# EAGLE design design (EAGLE 9.6.2)
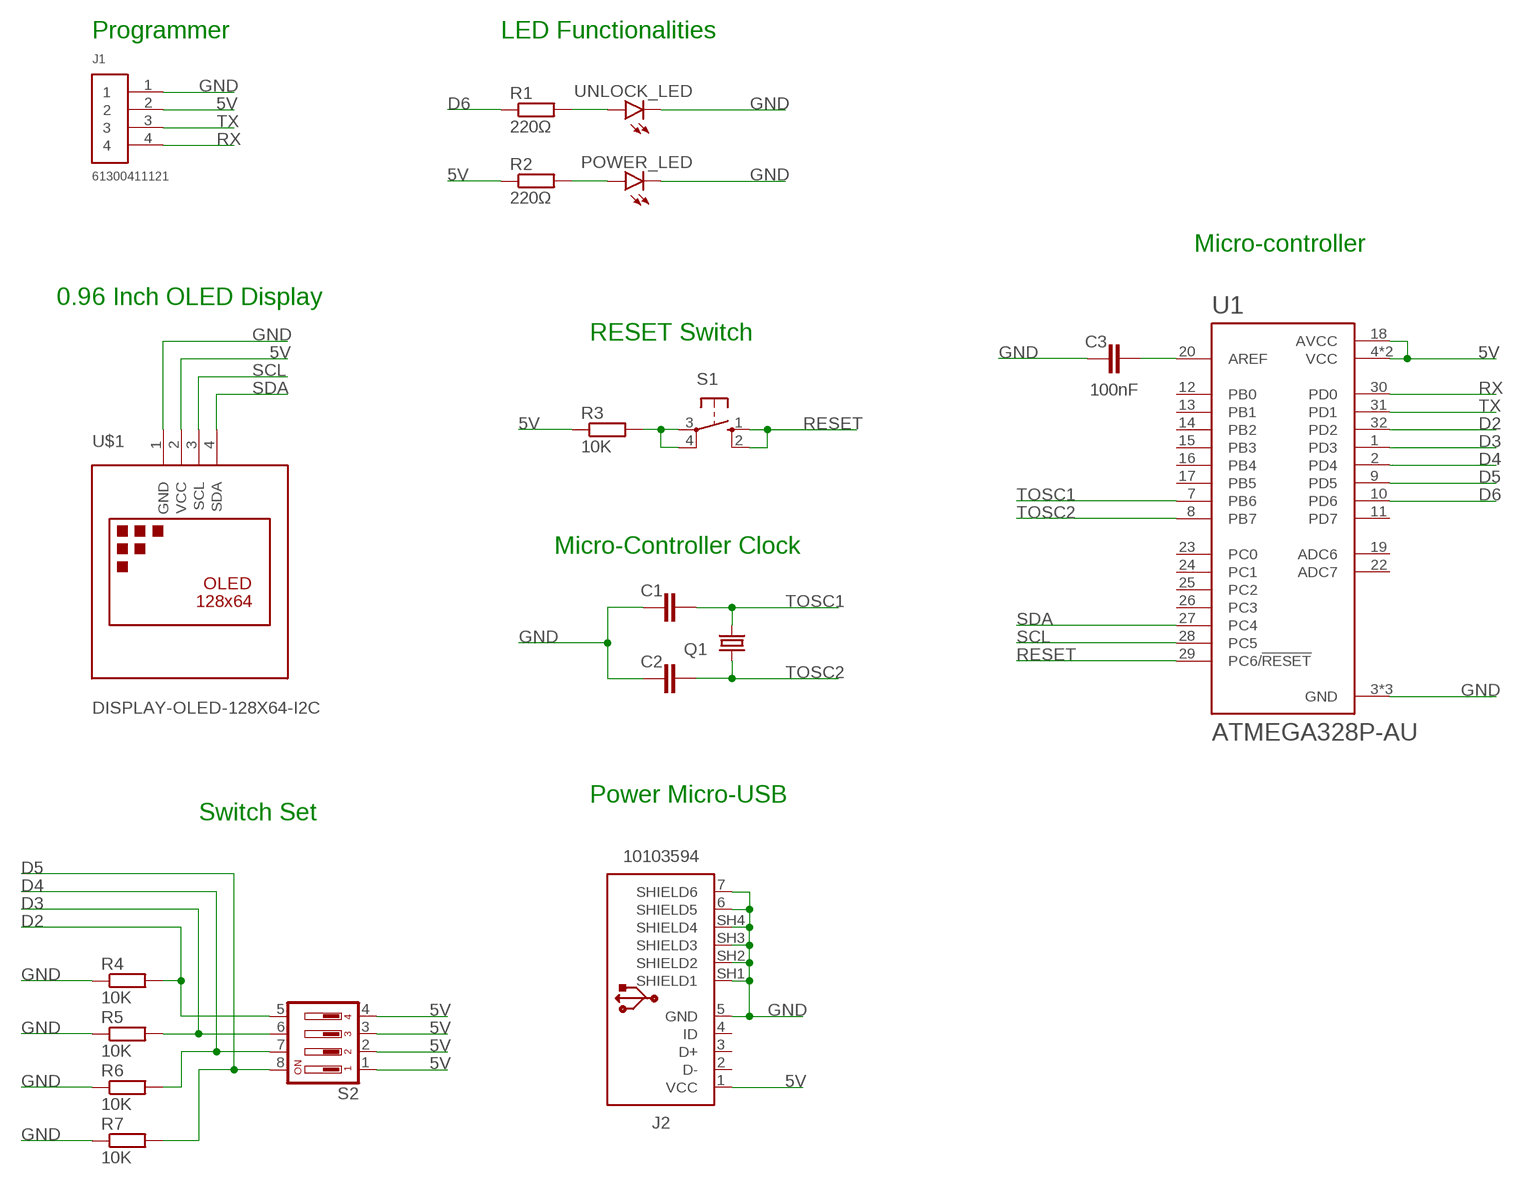
[diagram p0: schematic, sheet 1]

## Parts
C1  C-EUC0805  [C0805]
C2  C-EUC0805  [C0805]
C3  100nF  C-EUC0805  [C0805]
J1  61300411121  [61300411121]
J2  10103594  [10103594]
POWER_LED  LEDCHIP-LED0805  [CHIP-LED0805]
Q1  CRYSTALHC49U-V  [HC49U-V]
R1  220Ω  R-EU_R0805  [R0805]
R2  220Ω  R-EU_R0805  [R0805]
R3  10K  R-EU_R0805  [R0805]
R4  10K  R-EU_R0805  [R0805]
R5  10K  R-EU_R0805  [R0805]
R6  10K  R-EU_R0805  [R0805]
R7  10K  R-EU_R0805  [R0805]
S1  10-XX  [B3F-10XX]
S2  DA04  [DA-04]
U1  ATMEGA328P-AU  [QFP80P900X900X120-32N]
U$1  DISPLAY-OLED-128X64-I2C  [DISPLAY-OLED-128X64-I2C]
UNLOCK_LED  LEDCHIP-LED0805  [CHIP-LED0805]

## Nets
5V: J1.2 J2.1(VCC) R2.1 R3.1 S2.1 S2.2 S2.3 S2.4 U1.4(VCC) U1.6(VCC) U1.18(AVCC) U$1.2(VCC)
D2: R4.2 S2.5 U1.32(PD2)
D3: R5.2 S2.6 U1.1(PD3)
D4: R6.2 S2.7 U1.2(PD4)
D5: R7.2 S2.8 U1.9(PD5)
D6: R1.1 U1.10(PD6)
GND: C1.1 C2.1 C3.1 J1.1 J2.5(GND) J2.6(SHIELD5) J2.7(SHIELD6) J2.SH1(SHIELD1) J2.SH2(SHIELD2) J2.SH3(SHIELD3) J2.SH4(SHIELD4) POWER_LED.C R4.1 R5.1 R6.1 R7.1 U1.3(GND) U1.5(GND) U1.21(GND) U$1.1(GND) UNLOCK_LED.C
N$1: R1.2 UNLOCK_LED.A
N$2: R3.2 S1.3(P) S1.4(P1)
N$3: POWER_LED.A R2.2
N$4: C3.2 U1.20(AREF)
RESET: S1.1(S) S1.2(S1) U1.29(PC6/!RESET)
RX: J1.4 U1.30(PD0)
SCL: U1.28(PC5) U$1.3(SCL)
SDA: U1.27(PC4) U$1.4(SDA)
TOSC1: C1.2 Q1.2 U1.7(PB6)
TOSC2: C2.2 Q1.1 U1.8(PB7)
TX: J1.3 U1.31(PD1)
Unconnected: J2.2(D-) J2.3(D+) J2.4(ID) U1.11(PD7) U1.12(PB0) U1.13(PB1) U1.14(PB2) U1.15(PB3) U1.16(PB4) U1.17(PB5) U1.19(ADC6) U1.22(ADC7) U1.23(PC0) U1.24(PC1) U1.25(PC2) U1.26(PC3)

## Notes on the sheet
- Programmer | LED Functionalities
- Micro-controller
- 0.96 Inch OLED Display
- RESET Switch
- Micro-Controller Clock
- Power Micro-USB
- Switch Set

## Library data of the parts
C1-C3 = resistor:C-EU: CAPACITOR, European symbol
J1 = Headers:61300411121: CONN HEADER VERT 4POS 2.54MM Manufacturer's datasheet <https://katalog.we-online.de/em/datasheet/6130xx11121.pdf>; CREATED_BY: PCBLayout.com; DIGI_KEY_PART_NUMBER: 732-5317-ND; MANUFACTURER: Wurth Electronics Inc.; MPN: 61300411121
J2 = Connector_USB:10103594: USB(2.0) Micro-B, RCPT, 5POS, SMD-THT-R/A Datasheet <https://cdn.amphenol-icc.com/media/wysiwyg/files/documentation/datasheet/inputoutput/io_usb_micro.pdf> Drawing <https://cdn.amphenol-icc.com/media/wysiwyg/files/drawing/10103594.pdf>; CATEGORY: Connectors; CONTACTS: 5; CURRENT-RATING: 1.8A; DESCRIPTION: CONN RCPT USB2.0 MICRO B SMD R/A; GENDER: Receptacle; MANUFACTURER: Amphenol ICC (FCI); MOUNT_TYPE: R/A; MPN: 10103594-0001LF; OPERATING_TEMPERATURE: -30°C ~ 80°C; PART_STATUS: ACTIVE; ROHS_COMPLIANT: COMPLIANT; SUB_CATEGORY: USB; TYPE: USB-micro B; VOLTAGE-RATING: 100VAC
POWER_LED UNLOCK_LED = led:LED: LED OSRAM: - CHIPLED LG R971, LG N971, LY N971, LG Q971, LY Q971, LO R971, LY R971 LH N974, LH R974 LS Q976, LO Q976, LY Q976 LO Q996 - Hyper CHIPLED LW Q18S LB Q993, LB Q99A, LB R99A - SideLED LS A670, LO A670, LY A670, LG A670, LP A670 LB A673, LV A673, LT A673, LW A673 LH A674 LY A675 LS A676, LA A676, LO A676, LY A676, LW A676 LS A679, LY A679, LG A679 - Hyper Micro SIDELED® LS Y876, LA Y876, LO Y876, LY Y876 LT Y87S - SmartLED LW L88C, LW L88S LB L89C, LB L89S, LG L890 LS L89K, LO L89K, LY L89K LS L896, LA L896, LO L896, LY L896 - TOPLED LS T670, LO T670, LY T670, LG T670, LP T670 LSG T670, LSP T670, LSY T670, LOP T670, LYG T670 LG T671, LOG T671, LSG T671 LB T673, LV T673, LT T673, LW T673 LH T674 LS T676, LA T676, LO T676, LY T676, LB T676, LH T676, LSB T676, LW T676 LB T67C, LV T67C, LT T67C, LS T67K, LO T67K, LY T67K, LW E67C LS E67B, LA E67B, LO E67B, LY E67B, LB E67C, LV E67C, LT E67C LW T67C LS T679, LY T679, LG T679 LS T770, LO T770, LY T770, LG T770, LP T770 LB T773, LV T773, LT T773, LW T773 LH T774 LS E675, LA E675, LY E675, LS T675 LS T776, LA T776, LO T776, LY T776, LB T776 LHGB T686 LT T68C, LB T68C - Hyper Mini TOPLED® LB M676 - Mini TOPLED Santana® LG M470 LS M47K, LO M47K, LY M47K Source: http://www.osram.convergy.de LUXEON: - LUMILED® LXK2-PW12-R00, LXK2-PW12-S00, LXK2-PW14-U00, LXK2-PW14-V00 LXK2-PM12-R00, LXK2-PM12-S00, LXK2-PM14-U00 LXK2-PE12-Q00, LXK2-PE12-R00, LXK2-PE12-S00, LXK2-PE14-T00, LXK2-PE14-U00 LXK2-PB12-K00, LXK2-PB12-L00, LXK2-PB12-M00, LXK2-PB14-N00, LXK2-PB14-P00, LXK2-PB14-Q00 LXK2-PR12-L00, LXK2-PR12-M00, LXK2-PR14-Q00, LXK2-PR14-R00 LXK2-PD12-Q00, LXK2-PD12-R00, LXK2-PD12-S00 LXK2-PH12-R00, LXK2-PH12-S00 LXK2-PL12-P00, LXK2-PL12-Q00, LXK2-PL12-R00 Source: www.luxeon.com KINGBRIGHT: KA-3528ASYC Source: www.kingbright.com
Q1 = crystal:CRYSTAL: CRYSTAL; OC_FARNELL: 1666969; OC_NEWARK: unknown
R1-R7 = resistor:R-EU_: RESISTOR, European symbol
S1 = switch-omron:10-XX: OMRON SWITCH; MPN: B3F-1000; OC_FARNELL: 176432; OC_NEWARK: 36M3542
S2 = switch-dil:DA04: DIL/CODE SWITCH; MPN: MCDA04; OC_FARNELL: 9471545; OC_NEWARK: 26M1090
U1 = ATMEGA328P-AU:ATMEGA328P-AU: ATmega Series 20 MHz 32 KB Flash 2 KB SRAM 8-Bit Microcontroller - TQFP-32 Check prices <https://pricing.snapeda.com/parts/ATMEGA328P-AU/Microchip%20Technology/view-part?ref=eda>; AVAILABILITY: In Stock; DESCRIPTION: AVR AVR® ATmega Microcontroller IC 8-Bit 20MHz 32KB (16K x 16) FLASH 32-TQFP (7x7); MF: Microchip Technology; MP: ATMEGA328P-AU; PACKAGE: TQFP-32 Microchip; PRICE: None
U$1 = diy-modules:DISPLAY-OLED-128X64-I2C: 128x64 Dot Matrix OLED Module based on SSD1306 chip Variant with I2C interface More details available here: http://www.instructables.com/id/Monochrome-096-i2c-OLED-display-with-arduino-SSD13/ SSD1306 datasheet: https://cdn-shop.adafruit.com/datasheets/SSD1306.pdf Click here to find device on ebay.com <http://www.ebay.com/sch/oled+display+128x64+iic> Note: There are two variants: I2C and SPI. Search for the proper version.

## Board
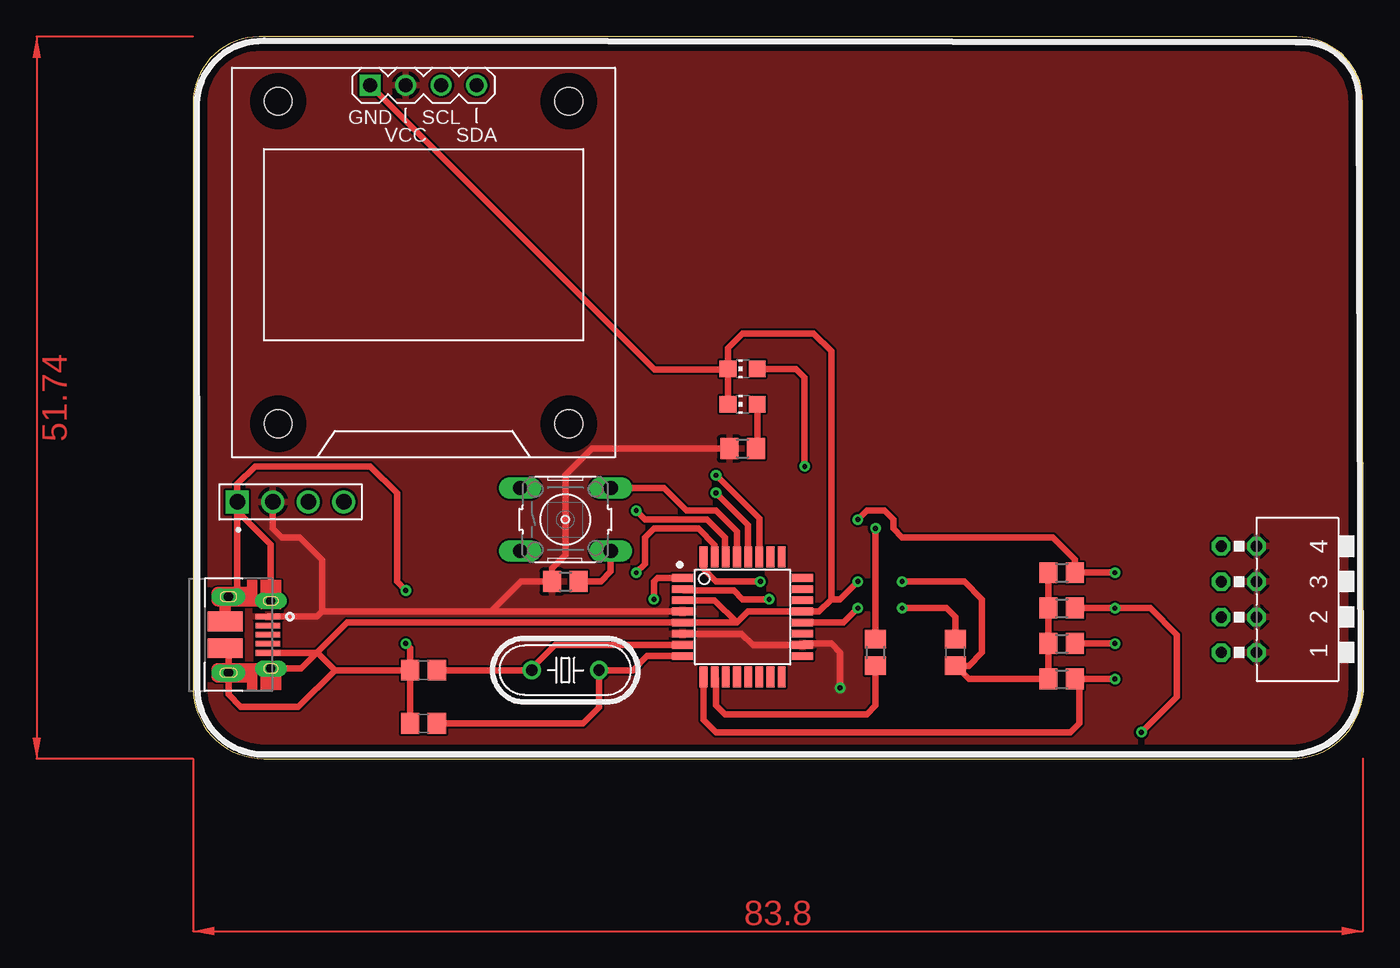
[diagram p1: board, top side]
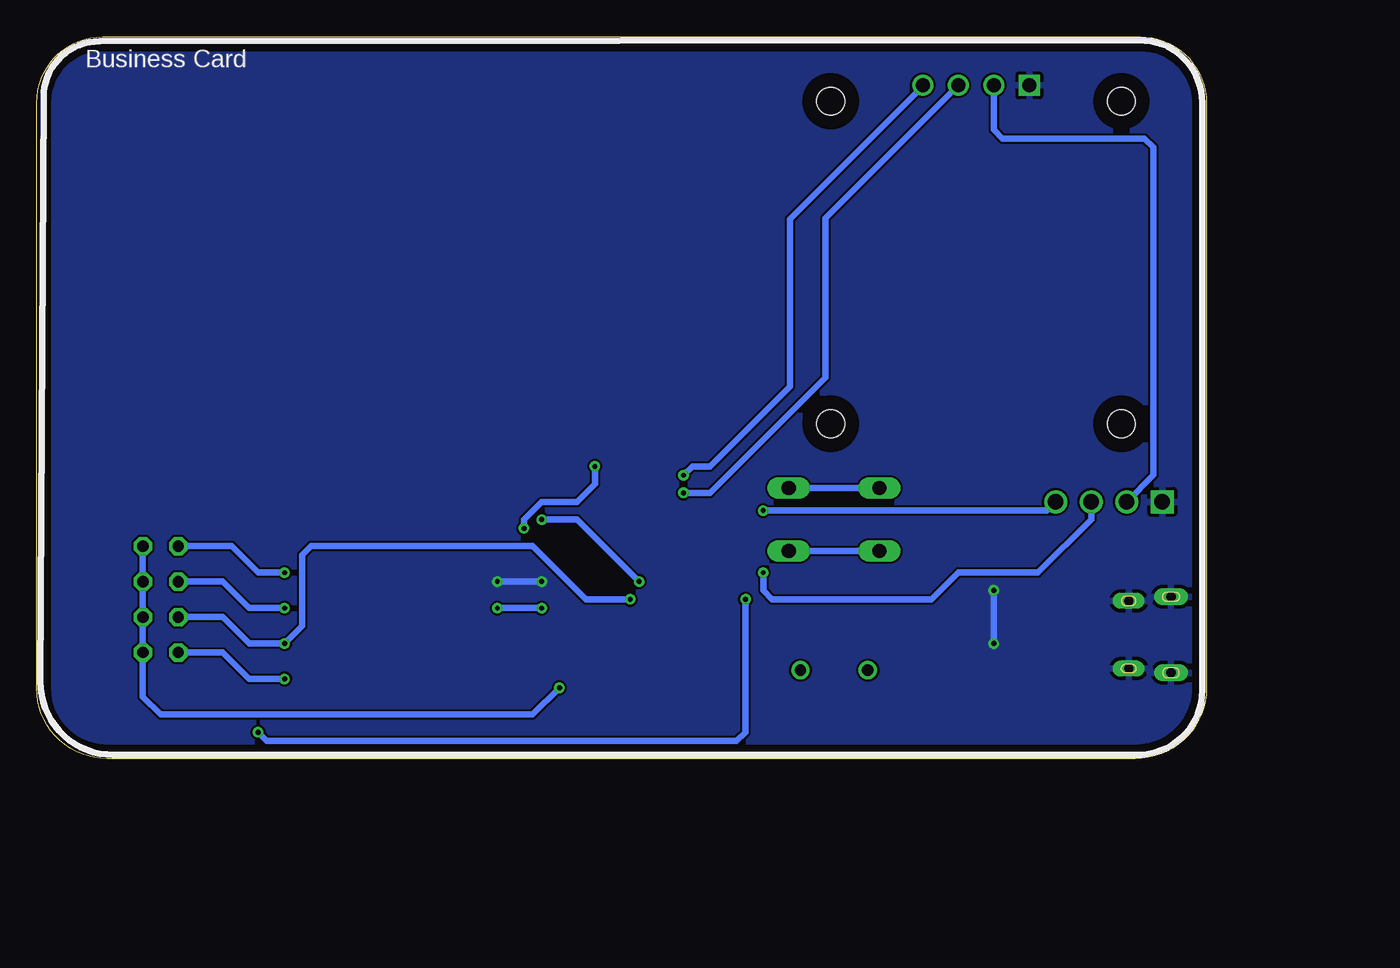
[diagram p2: board, bottom side, seen from below]

Size 83.8 x 51.74 mm. Coordinates in mm from the lower left corner, seen from the top.
Outline: 0,46.99 0,5.08 arc90 5.08,0 78.74,0 arc90 83.8,5.06 83.8,47.01 arc90 79.07,51.74 4.75,51.74 arc90 0,46.99
Copper layers (1*16): Top 0.035mm / dielectric 1.5mm / Bottom 0.035mm
Design rules "default": minimum track width 6mil, minimum drill 0.35mm, track to track 6mil, track to pad 6mil, pad to pad 6mil, via to via 6mil, smd to smd 6mil, copper to edge 40mil, drill to drill 6mil, minimum pad ring 10mil, minimum via ring 8mil, stop-mask expansion 4mil, vias tented up to drill 0mil, thermal gap 10mil

### Footprints (pad centres in the part's own frame; a part is rotated, then mirrored left to right if it is on the bottom)
C0805 = smd 1.3 x 1.5: 1 -0.95,0; 2 0.95,0
61300411121 = drill 1.1 square: 1 -3.81,0 | drill 1.1: 2 -1.27,0; 3 1.27,0; 4 3.81,0
10103594 = smd 0.4 x 1.75: 1 -1.3,2.825; 2 -0.65,2.825; 3 0,2.825; 4 0.65,2.825; 5 1.3,2.825 | smd 1.425 x 2.5: 6 -0.963,-0.25; 7 0.963,-0.25 | drill 0.65 pad 0.73 long: SH1 -2.425,3.03; SH2 2.425,3.03 | drill 0.7 long: SH3 -2.725,0; SH4 2.725,0
CHIP-LED0805 = smd 1.2 x 1.2: A 0,-1.05; C 0,1.05
HC49U-V = drill 0.813: 1 -2.413,0; 2 2.413,0
R0805 = smd 1.3 x 1.5: 1 -0.95,0; 2 0.95,0
B3F-10XX = drill 1.016 long: 1 -3.251,2.261; 2 3.251,2.261; 3 -3.251,-2.261; 4 3.251,-2.261
DA-04 = drill 0.813 octagon: 1 -3.81,-1.27; 2 -1.27,-1.27; 3 1.27,-1.27; 4 3.81,-1.27; 5 3.81,1.27; 6 1.27,1.27; 7 -1.27,1.27; 8 -3.81,1.27
QFP80P900X900X120-32N = smd 1.5 x 0.55: 1 -4.3,2.8; 2 -4.3,2; 3 -4.3,1.2; 4 -4.3,0.4; 5 -4.3,-0.4; 6 -4.3,-1.2; 7 -4.3,-2; 8 -4.3,-2.8; 17 4.3,-2.8; 18 4.3,-2; 19 4.3,-1.2; 20 4.3,-0.4; 21 4.3,0.4; 22 4.3,1.2; 23 4.3,2; 24 4.3,2.8 | smd 0.55 x 1.5: 9 -2.8,-4.3; 10 -2,-4.3; 11 -1.2,-4.3; 12 -0.4,-4.3; 13 0.4,-4.3; 14 1.2,-4.3; 15 2,-4.3; 16 2.8,-4.3; 25 2.8,4.3; 26 2,4.3; 27 1.2,4.3; 28 0.4,4.3; 29 -0.4,4.3; 30 -1.2,4.3; 31 -2,4.3; 32 -2.8,4.3
DISPLAY-OLED-128X64-I2C = drill 1 square: 1 -3.81,12.7 | drill 1: 2 -1.27,12.7; 3 1.27,12.7; 4 3.81,12.7 | hole 2: -10.414,11.557; 10.414,11.557; 10.414,-11.557; -10.414,-11.557

### Placement (x,y rotation side)
C1  16.51,6.35 0 top
C2  16.51,2.54 0 top
C3  54.61,7.62 90 top
J1  6.99,18.41 0 top
J2  2.54,8.89 270 top
POWER_LED  39.37,25.4 90 top
Q1  26.67,6.35 180 top
R1  48.9,7.62 90 top
R2  39.37,22.22 0 top
R3  26.67,12.7 0 top
R4  62.23,13.33 0 top
R5  62.23,10.79 0 top
R6  62.23,8.25 0 top
R7  62.23,5.72 0 top
S1  26.67,17.14 0 top
S2  74.93,11.43 90 top
U1  39.37,10.16 0 top
U$1  16.51,35.56 0 top
UNLOCK_LED  39.37,27.94 90 top

### Tracks (layer width: path | path; a pad name or v marks a point on that pad's centre or on a via)
5V  (via drill 0.35)
  Top 0.152: 8.86,10.19 8.92,10.19 8.92,10.22 | U1.18 43.76,8.25
  Top 0.457: J2.1 8.86,10.19 | U1.18 40.1,8.16 39.3,8.96 U1.6 | U1.4 21.35,10.56 | 21.35,10.56 9.26,10.56 | 9.26,10.56 8.92,10.22 | R2.1 28.57,22.22 26.67,20.32 26.67,14.6 25.72,13.65 R3.1 23.49,12.7 21.35,10.56 | 43.76,8.25 45.72,8.25 46.35,7.62 v46.35,5.08 | J1.2 5.71,16.51 6.35,15.87 7.62,15.87 9.26,14.23 9.26,10.56
  Bottom 0.457: S2.4 S2.3 S2.2 S2.1 76.2,4.44 74.93,3.17 48.26,3.17 v46.35,5.08 | J1.2 3.81,20.32 3.81,43.81 4.44,44.45 14.6,44.45 15.24,45.08 U$1.2
  pour Top: 0.36,46.48 arc-90 4.78,50.9 4.78,51.13 80.37,51.13 arc-90 83.26,48.23 83.26,4.11 arc-90 79.38,0.23 4.78,0.23 arc-90 0.28,4.72 0.28,46.41
D2  (via drill 0.35)
  Top 0.457: v66.04,13.33 R4.2 63.18,14.29 61.59,15.87 50.8,15.87 50.16,16.51 50.16,17.14 49.53,17.78 48.26,17.78 v47.62,17.14 | U1.32 36.57,13.59 37.46,12.7 v40.64,12.7
  Bottom 0.457: S2.5 69.85,15.24 67.94,13.33 v66.04,13.33 | v40.64,12.7 45.08,17.14 v47.62,17.14
D3  (via drill 0.35)
  Top 0.457: R5.2 v66.04,10.79 68.58,10.79 70.48,8.89 70.48,4.44 v67.94,1.9 | U1.1 33.28,12.96 33.02,12.7 v33.02,11.43
  Bottom 0.457: v66.04,10.79 68.58,10.79 70.48,12.7 S2.6 | v33.02,11.43 33.02,1.9 33.65,1.27 67.31,1.27 v67.94,1.9
D4  (via drill 0.35)
  Top 0.457: R6.2 v66.04,8.25 | U1.2 35.16,12.06 38.73,12.06 39.37,11.43 v41.27,11.43
  Bottom 0.457: S2.7 70.48,10.16 68.58,8.25 v66.04,8.25 64.77,9.52 64.77,14.6 64.13,15.24 48.26,15.24 44.45,11.43 v41.27,11.43
D5  (via drill 0.35)
  Top 0.457: v66.04,5.71 R7.2 63.5,5.39 63.5,2.54 62.86,1.9 37.46,1.9 36.57,2.8 U1.9
  Bottom 0.457: v66.04,5.71 68.58,5.71 70.48,7.62 S2.8
D6
  Top 0.152: U1.10 37.46,5.76
  Top 0.457: 37.46,5.76 37.46,3.81 38.1,3.17 48.26,3.17 48.89,3.81 R1.1
GND  (via drill 0.35)
  Top 0.152: 2.54,7.68 J2.7 | 2.29,11.36 J2.SH3 3.17,12.25 | 8.86,7.59 8.89,7.62
  Top 0.457: C2.1 C1.1 | 8.89,7.62 10.16,6.35 | 10.16,6.35 C1.1 | 8.89,7.62 11.03,9.76 U1.5 38.97,9.76 | 38.97,9.76 39.77,10.56 U1.21 44.85,10.56 45.72,11.43 | 38.32,27.89 UNLOCK_LED.C 38.32,29.43 39.37,30.48 44.45,30.48 45.72,29.21 45.72,11.43 | 38.32,27.89 POWER_LED.C | U$1.1 33.07,27.89 38.32,27.89 | 45.72,11.43 46.35,11.43 v47.62,12.7 | v50.8,12.7 55.24,12.7 56.51,11.43 56.51,7.62 55.56,6.67 C3.1 55.56,5.71 R7.1 R6.1 R5.1 R4.1 | v15.24,12.06 14.6,12.7 14.6,19.05 12.7,20.95 4.44,20.95 3.17,19.68 J1.1 3.17,17.75 | C1.1 15.56,7.93 v15.24,8.25 | 10.16,6.35 7.54,3.73 3.4,3.73 2.54,4.6 J2.SH4 2.54,7.68 | J2.SH3 3.04,12.12 3.63,12.12 | 3.17,12.25 3.17,17.75 | J2.SH1 5.57,15.36 3.17,17.75 | U1.3 37.37,11.36 38.97,9.76 | J2.SH2 7.73,6.46 8.89,7.62 | J2.5 8.86,7.59
  Top 0.813: J2.6 2.29,11.36
  Bottom 0.457: v47.62,12.7 v50.8,12.7 | v15.24,12.06 v15.24,8.25
  pour Bottom: 4.7,50.83 80.52,50.83 arc-90 83.03,48.31 83.03,3.35 arc-90 79.91,0.23 4.7,0.23 arc-90 0.36,4.57 0.36,46.48 arc-90
N$1  (via drill 0.35)
  Top 0.457: UNLOCK_LED.A 43.18,27.94 43.81,27.3 v43.81,20.95 | R1.2 v48.89,16.51
  Bottom 0.457: v43.81,20.95 43.81,19.68 45.08,18.41 47.62,18.41 48.89,17.14 v48.89,16.51
N$2
  Top 0.457: S1.4 29.92,13.41 29.21,12.7 R3.2
  Bottom 0.457: S1.3 S1.4
N$3
  Top 0.152: 40.42,22.32 R2.2
  Top 0.457: POWER_LED.A 40.42,22.32
N$4  (via drill 0.35)
  Top 0.457: U1.20 46.59,9.76 v47.62,10.79 | v50.8,10.79 53.97,10.79 54.61,10.16 C3.2
  Bottom 0.457: v47.62,10.79 v50.8,10.79
RESET
  Top 0.457: S1.2 33.73,19.41 35.36,17.78 37.46,17.78 38.97,16.27 U1.29
  Bottom 0.457: S1.2 S1.1
RX  (via drill 0.35)
  Top 0.457: U1.30 38.1,14.53 38.1,15.87 36.83,17.14 32.38,17.14 v31.75,17.78
  Bottom 0.457: v31.75,17.78 11.43,17.78 J1.4
SCL  (via drill 0.35)
  Top 0.457: U1.28 39.77,16.74 v37.46,19.05
  Bottom 0.457: U$1.3 27.3,38.73 27.3,27.3 35.56,19.05 v37.46,19.05
SDA  (via drill 0.35)
  Top 0.457: U1.27 40.57,17.21 v37.46,20.32
  Bottom 0.457: v37.46,20.32 36.83,20.95 35.56,20.95 29.84,26.67 29.84,38.67 20.32,48.2 U$1.4
TOSC1
  Top 0.152: 24.26,6.48 Q1.2
  Top 0.457: C1.2 Q1.2 | U1.7 25.94,8.16 24.26,6.48
TOSC2
  Top 0.457: C2.2 27.94,2.54 29.08,3.68 Q1.1 31.52,6.35 32.53,7.36 U1.8
TX  (via drill 0.35)
  Top 0.457: U1.31 37.37,15.33 36.19,16.51 33.02,16.51 32.38,15.87 32.38,13.97 v31.75,13.33
  Bottom 0.457: J1.3 8.25,17.14 12.06,13.33 17.78,13.33 19.68,11.43 31.11,11.43 31.75,12.06 v31.75,13.33
(copper drawn outside any net)
  shapes: Top area x2

### Text on the board
bPlace: Business Card
tStop: Sashwat K | Entrepreneur | Tech Enthusiast | - sashwat.in / - hi@sashwat.in